# Altium schematic sheet Sensors.SchDoc: Payload Card Sensors
size A3; Revision: 1A; SheetNumber: 5; SheetTotal: 6; Organization: Brickworks; Address1: Matthew Glazer; Address2: Design Engineer
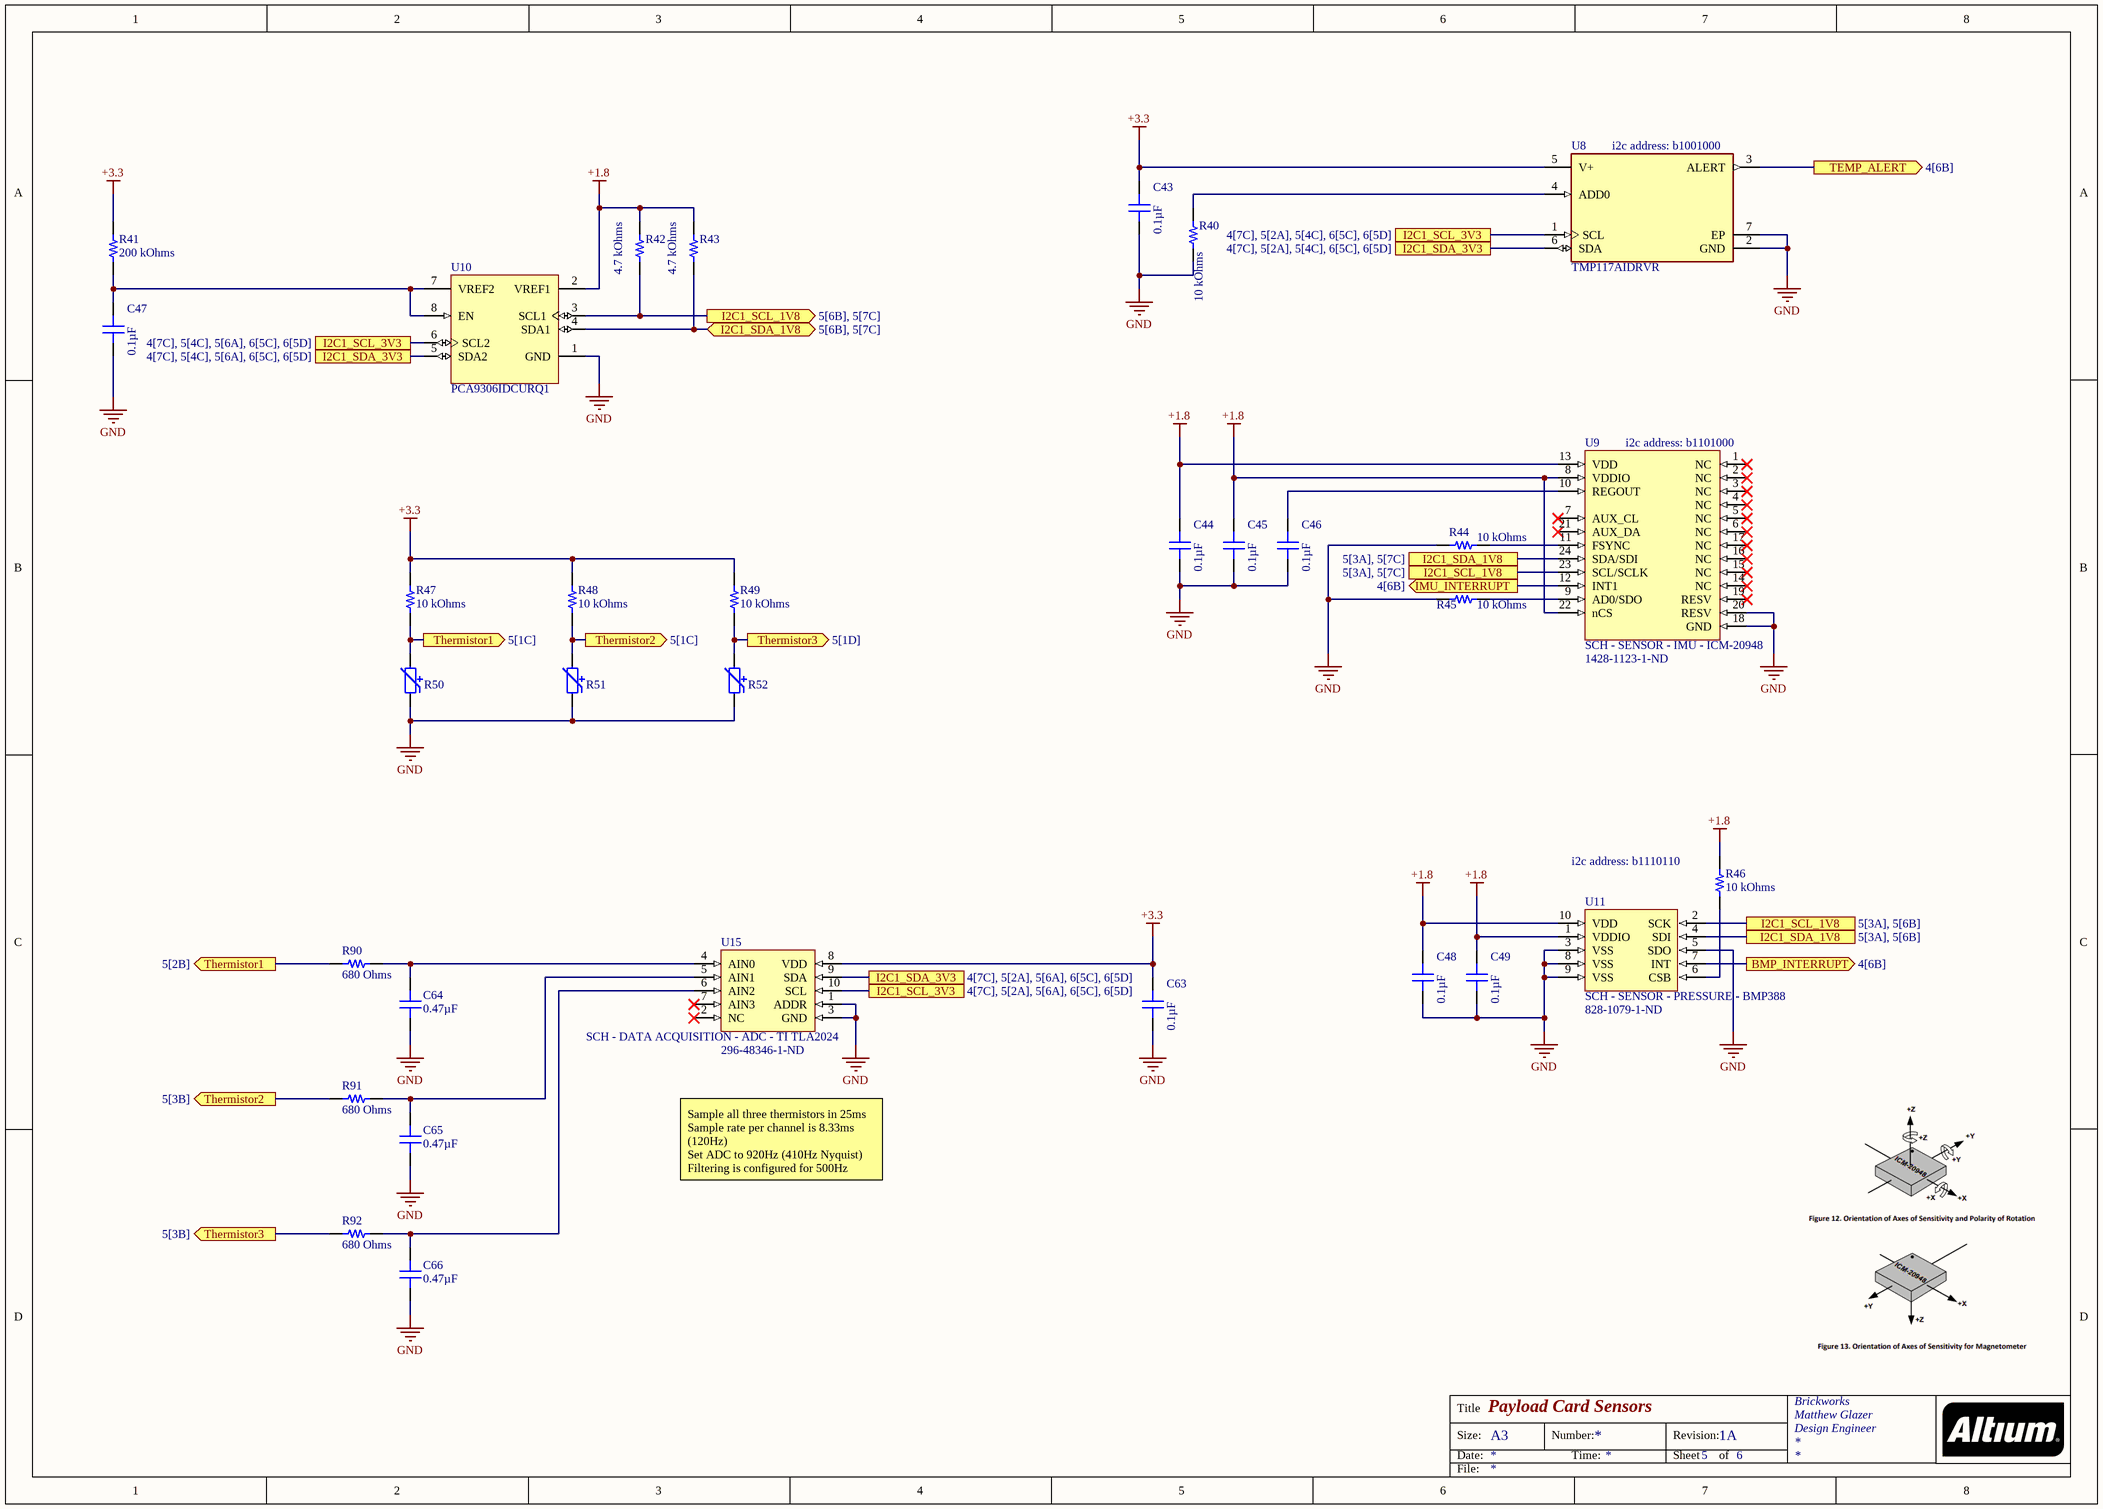
[diagram p0: Sensors.SchDoc]

## Parts
C43  0.1µF  [CAP 0603_1608]
C44  0.1µF  [CAP 0603_1608]
C45  0.1µF  [CAP 0603_1608]
C46  0.1µF  [CAP 0603_1608]
C47  0.1µF  [CAP 0603_1608]
C48  0.1µF  [CAP 0603_1608]
C49  0.1µF  [CAP 0603_1608]
C63  0.1µF  [CAP 0603_1608]
C64  0.47µF  [CAP 0603_1608]
C65  0.47µF  [CAP 0603_1608]
C66  0.47µF  [CAP 0603_1608]
R40  10 kOhms  [RES 0603_1608]
R41  200 kOhms  [RES 0603_1608]
R42  4.7 kOhms  [RES 0603_1608]
R43  4.7 kOhms  [RES 0603_1608]
R44  10 kOhms  [RES 0603_1608]
R45  10 kOhms  [RES 0603_1608]
R46  10 kOhms  [RES 0603_1608]
R47  10 kOhms  [RES 0603_1608]
R48  10 kOhms  [RES 0603_1608]
R49  10 kOhms  [RES 0603_1608]
R50  10 kOhms  [PTC 0402_1005]  (value not drawn)
R51  10 kOhms  [PTC 0402_1005]  (value not drawn)
R52  10 kOhms  [PTC 0402_1005]  (value not drawn)
R90  680 Ohms  [RES 0603_1608]
R91  680 Ohms  [RES 0603_1608]
R92  680 Ohms  [RES 0603_1608]
U8  TMP117AIDRVR  [FP-DRV0006A-MFG]
U9  SCH - SENSOR - IMU - ICM-20948  Supplier Part Number 1: 1428-1123-1-ND  [PCB - LEADLESS - QFN - TDK 24-TFQFN]
U10  PCA9306IDCURQ1  [DCU0008A_M]
U11  SCH - SENSOR - PRESSURE - BMP388  Supplier Part Number 1: 828-1079-1-ND  [PCB - LEADLESS - BOSCH LGA10]
U15  SCH - DATA ACQUISITION - ADC - TI TLA2024  Supplier Part Number 1: 296-48346-1-ND  [PCB - LEADLESS - QFN - TI X2QFN-10]

## Ports
BMP_INTERRUPT (out, see 4[6B]), I2C1_SCL_1V8 (out, see 5[6B], 5[7C]), I2C1_SCL_1V8 (see 5[3A], 5[6B]), I2C1_SCL_1V8 (see 5[3A], 5[7C]), I2C1_SCL_3V3 (see 4[7C], 5[2A], 5[4C], 6[5C], 6[5D]), I2C1_SCL_3V3 (see 4[7C], 5[2A], 5[6A], 6[5C], 6[5D]), I2C1_SCL_3V3 (see 4[7C], 5[4C], 5[6A], 6[5C], 6[5D]), I2C1_SDA_1V8 (bidir, see 5[6B], 5[7C]), I2C1_SDA_1V8 (see 5[3A], 5[6B]), I2C1_SDA_1V8 (see 5[3A], 5[7C]), I2C1_SDA_3V3 (see 4[7C], 5[2A], 5[4C], 6[5C], 6[5D]), I2C1_SDA_3V3 (see 4[7C], 5[2A], 5[6A], 6[5C], 6[5D]), I2C1_SDA_3V3 (see 4[7C], 5[4C], 5[6A], 6[5C], 6[5D]), IMU_INTERRUPT (out, see 4[6B]), TEMP_ALERT (out, see 4[6B]), Thermistor1 (out, see 5[1C]), Thermistor1 (out, see 5[2B]), Thermistor2 (out, see 5[1C]), Thermistor2 (out, see 5[3B]), Thermistor3 (out, see 5[1D]), Thermistor3 (out, see 5[3B])

## Nets
+1.8: C44.2 C45.2 C48.2 C49.2 R42.2 R43.2 R46.1 U9.8(VDDIO) U9.13(VDD) U9.22(nCS) U10.2(VREF1) U11.1(VDDIO) U11.10(VDD)
+3.3: C43.2 C63.2 R41.2 R47.2 R48.2 R49.2 U8.5(V+) U15.8(VDD)
GND: C43.1 C44.1 C45.1 C46.1 C47.1 C48.1 C49.1 C63.1 C64.1 C65.1 C66.1 R40.1 R44.2 R45.2 R50.1 R51.1 R52.1 U8.2(GND) U8.7(EP) U9.18(GND) U9.20(RESV) U10.1(GND) U11.3(VSS) U11.5(SDO) U11.8(VSS) U11.9(VSS) U15.1(ADDR) U15.3(GND)
BMP_INTERRUPT: U11.7(INT) ; port BMP_INTERRUPT
I2C1_SCL_1V8: R42.1 U9.23(SCL/SCLK) U10.3(SCL1) U11.2(SCK) ; port I2C1_SCL_1V8
I2C1_SCL_3V3: U8.1(SCL) U10.6(SCL2) U15.10(SCL) ; port I2C1_SCL_3V3
I2C1_SDA_1V8: R43.1 U9.24(SDA/SDI) U10.4(SDA1) U11.4(SDI) ; port I2C1_SDA_1V8
I2C1_SDA_3V3: U8.6(SDA) U10.5(SDA2) U15.9(SDA) ; port I2C1_SDA_3V3
IMU_INTERRUPT: U9.12(INT1) ; port IMU_INTERRUPT
TEMP_ALERT: U8.3(ALERT) ; port TEMP_ALERT
Thermistor1: R47.1 R50.2 R90.1 ; port Thermistor1
Thermistor2: R48.1 R51.2 R91.1 ; port Thermistor2
Thermistor3: R49.1 R52.2 R92.1 ; port Thermistor3
NetC46_2: C46.2 U9.10(REGOUT)
NetC47_2: C47.2 R41.1 U10.7(VREF2) U10.8(EN)
NetC64_2: C64.2 R90.2 U15.4(AIN0)
NetC65_2: C65.2 R91.2 U15.5(AIN1)
NetC66_2: C66.2 R92.2 U15.6(AIN2)
NetR40_2: R40.2 U8.4(ADD0)
NetR44_1: R44.1 U9.11(FSYNC)
NetR45_1: R45.1 U9.9(AD0/SDO)
NetR46_2: R46.2 U11.6(CSB)

Not connected (* = marked no-connect by the designer): U9 1(NC)* 2(NC)* 3(NC)* 4(NC)* 5(NC)* 6(NC)* 7(AUX_CL)* 14(NC)* 15(NC)* 16(NC)* 17(NC)* 19(RESV)* 21(AUX_DA)*; U15 2(NC)* 7(AIN3)*

## Notes on the sheet
- (near U8) i2c address: b1001000
- (near U9) i2c address: b1101000
- (near R46) i2c address: b1110110
- Sample all three thermistors in 25ms
  Sample rate per channel is 8.33ms (120Hz)
  Set ADC to 920Hz (410Hz Nyquist)
  Filtering is configured for 500Hz
- Title
- Size:
- Date:
- A3
- Number:
- Time:
- Revision:
- Sheet
- of
- File:

## Library data of the parts
C43-C49 C63 = CL10B104KA8WPNC: CAP CER 0.1UF 25V X7R 0603; Manufacturer: Samsung Electro-Mechanics; Tolerance: ±10%; Part Number: CL10B104KA8WPNC; Value: 0.1µF; Applications: Automotive; Capacitance: 0.1µF; ComponentLink1Description: Datasheet; ComponentLink1URL: http://www.samsungsem.com/kr/support/product-search/mlcc/CL10B104KA8WPNC.jsp; ComponentLink2Description: DigiKey Link; ComponentLink2URL: http://digikey.com/product-detail/en/samsung-electro-mechanics/CL10B104KA8WPNC/1276-6717-1-ND/5961576; Device Package: 0603 (1608 Metric); Features: Open Mode; LastUpdated: 9/2/2020 1:03:30 AM; Lifecycle Status: Active; Minimum Order: 1; Mounting Type: Surface Mount, MLCC; Operating Temperature: -55°C ~ 125°C; Package / Case: 0603 (1608 Metric); Packaging: TapeAndReel; PartId: 5631; Part Status: Active; Price: 0.02; Ratings: AEC-Q200; Series: CL; Size / Dimension: 0.063" L x 0.031" W (1.60mm x 0.80mm); Supplier 1: DigiKey; Supplier Part Number 1: 1276-6717-1-ND; Temperature Coefficient: X7R; Thickness (Max): 0.035" (0.90mm); Voltage - Rated: 25V
C64-C66 = C0603C474K4PACTU: CAP CER 0.47UF 16V X5R 0603; Manufacturer: KEMET; Tolerance: ±10%; Part Number: C0603C474K4PACTU; Value: 0.47µF; Applications: General Purpose; Capacitance: 0.47µF; ComponentLink1Description: Datasheet; ComponentLink1URL: https://api.kemet.com/component-edge/download/datasheet/C0603C474K4PACTU.pdf; ComponentLink2Description: DigiKey Link; ComponentLink2URL: http://digikey.com/product-detail/en/kemet/C0603C474K4PACTU/399-7934-1-ND/3471657; Device Package: 0603 (1608 Metric); LastUpdated: 9/2/2020 1:03:36 AM; Lifecycle Status: Active; Minimum Order: 1; Mounting Type: Surface Mount, MLCC; Operating Temperature: -55°C ~ 85°C; Package / Case: 0603 (1608 Metric); Packaging: TapeAndReel; PartId: 2292; Part Status: Active; Price: 0.02; Series: SMD Comm X5R; Size / Dimension: 0.063" L x 0.031" W (1.60mm x 0.80mm); Supplier 1: DigiKey; Supplier Part Number 1: 399-7934-1-ND; Temperature Coefficient: X5R; Thickness (Max): 0.034" (0.87mm); Voltage - Rated: 16V
R40 R44-R46 = RMCF0603JT10K0: RES 10K OHM 5% 1/10W 0603; Manufacturer: Stackpole Electronics Inc; Power (Watts): 0.1W, 1/10W; Temperature Coefficient: ±200ppm/°C; Part Number: RMCF0603JT10K0; Value: 10 kOhms; ComponentLink1Description: Datasheet; ComponentLink1URL: https://www.seielect.com/catalog/sei-packaging.pdf; ComponentLink2Description: DigiKey Link; ComponentLink2URL: http://digikey.com/product-detail/en/stackpole-electronics-inc/RMCF0603JT10K0/RMCF0603JT10K0CT-ND/1943191; Composition: Thick Film; Device Package: 0603 (1608 Metric); Features: Automotive AEC-Q200; Height - Seated (Max): 0.022" (0.55mm); LastUpdated: 8/30/2020 8:48:45 PM; Lifecycle Status: Active; Minimum Order: 1; Number of Terminations: 2; Operating Temperature: -55°C ~ 155°C; Package / Case: 0603 (1608 Metric); Packaging: CutTape; PartId: 25659; Part Status: Active; Price: 0.10; Ratings: AEC-Q200; Resistance: 10 kOhms; Series: RMCF; Size / Dimension: 0.061" L x 0.031" W (1.55mm x 0.80mm); Supplier 1: DigiKey; Supplier Part Number 1: RMCF0603JT10K0CT-ND; Supplier Device Package: 0603; Tolerance: ±5%
R41 = RMCF0603FT200K: RES 200K OHM 1% 1/10W 0603; Manufacturer: Stackpole Electronics Inc; Power (Watts): 0.1W, 1/10W; Temperature Coefficient: ±100ppm/°C; Part Number: RMCF0603FT200K; Value: 200 kOhms; ComponentLink1Description: Datasheet; ComponentLink1URL: https://www.seielect.com/catalog/sei-rmcf_rmcp.pdf; ComponentLink2Description: DigiKey Link; ComponentLink2URL: http://digikey.com/product-detail/en/stackpole-electronics-inc/RMCF0603FT200K/RMCF0603FT200KCT-ND/1943126; Composition: Thick Film; Device Package: 0603 (1608 Metric); Features: Automotive AEC-Q200; Height - Seated (Max): 0.022" (0.55mm); LastUpdated: 9/2/2020 1:10:13 AM; Lifecycle Status: Active; Minimum Order: 1; Number of Terminations: 2; Operating Temperature: -55°C ~ 155°C; Package / Case: 0603 (1608 Metric); Packaging: CutTape; PartId: 10646; Part Status: Active; Price: 0.10; Ratings: AEC-Q200; Resistance: 200 kOhms; Series: RMCF; Size / Dimension: 0.061" L x 0.031" W (1.55mm x 0.80mm); Supplier 1: DigiKey; Supplier Part Number 1: RMCF0603FT200KCT-ND; Supplier Device Package: 0603; Tolerance: ±1%
R42 R43 = RMCF0603FT4K70: RES 4.7K OHM 1% 1/10W 0603; Manufacturer: Stackpole Electronics Inc; Power (Watts): 0.1W, 1/10W; Temperature Coefficient: ±100ppm/°C; Part Number: RMCF0603FT4K70; Value: 4.7 kOhms; ComponentLink1Description: Datasheet; ComponentLink1URL: https://www.seielect.com/catalog/sei-rmcf_rmcp.pdf; ComponentLink2Description: DigiKey Link; ComponentLink2URL: http://digikey.com/product-detail/en/stackpole-electronics-inc/RMCF0603FT4K70/RMCF0603FT4K70CT-ND/1943033; Composition: Thick Film; Device Package: 0603 (1608 Metric); Features: Automotive AEC-Q200; Height - Seated (Max): 0.022" (0.55mm); LastUpdated: 9/2/2020 1:10:22 AM; Lifecycle Status: Active; Minimum Order: 1; Number of Terminations: 2; Operating Temperature: -55°C ~ 155°C; Package / Case: 0603 (1608 Metric); Packaging: CutTape; PartId: 6078; Part Status: Active; Price: 0.10; Ratings: AEC-Q200; Resistance: 4.7 kOhms; Series: RMCF; Size / Dimension: 0.061" L x 0.031" W (1.55mm x 0.80mm); Supplier 1: DigiKey; Supplier Part Number 1: RMCF0603FT4K70CT-ND; Supplier Device Package: 0603; Tolerance: ±1%
R47-R49 = RMCF0603FT10K0: RES 10K OHM 1% 1/10W 0603; Manufacturer: Stackpole Electronics Inc; Power (Watts): 0.1W, 1/10W; Temperature Coefficient: ±100ppm/°C; Part Number: RMCF0603FT10K0; Value: 10 kOhms; ComponentLink1Description: Datasheet; ComponentLink1URL: https://www.seielect.com/catalog/sei-rmcf_rmcp.pdf; ComponentLink2Description: DigiKey Link; ComponentLink2URL: http://digikey.com/product-detail/en/stackpole-electronics-inc/RMCF0603FT10K0/RMCF0603FT10K0CT-ND/1943057; Composition: Thick Film; Device Package: 0603 (1608 Metric); Features: Automotive AEC-Q200; Height - Seated (Max): 0.022" (0.55mm); LastUpdated: 9/2/2020 1:09:31 AM; Lifecycle Status: Active; Minimum Order: 1; Number of Terminations: 2; Operating Temperature: -55°C ~ 155°C; Package / Case: 0603 (1608 Metric); Packaging: CutTape; PartId: 25663; Part Status: Active; Price: 0.10; Ratings: AEC-Q200; Resistance: 10 kOhms; Series: RMCF; Size / Dimension: 0.061" L x 0.031" W (1.55mm x 0.80mm); Supplier 1: DigiKey; Supplier Part Number 1: RMCF0603FT10K0CT-ND; Supplier Device Package: 0603; Tolerance: ±1%
R50-R52 = TMP6131DECR: SENSOR PTC 10KOHM 1% X1SON; Manufacturer: Texas Instruments; ComponentLink1Description: Datasheet; ComponentLink1URL: http://www.ti.com/general/docs/suppproductinfo.tsp?distId=10&gotoUrl=http%3A%2F%2Fwww.ti.com%2Flit%2Fgpn%2Ftmp61; ComponentLink2Description: DigiKey Link; ComponentLink2URL: http://digikey.com/product-detail/en/texas-instruments/TMP6131DECR/296-TMP6131DECRCT-ND/10435285; Device Package: 0402 (1006 Metric); LastUpdated: 9/2/2020 1:30:57 AM; Lifecycle Status: Active; Part Number: TMP6131DECR; Minimum Order: 1; Mounting Type: Surface Mount; Operating Temperature: -40°C ~ 125°C (TA); Package / Case: 0402 (1006 Metric); Packaging: TapeAndReel; Part Status: Active; Price: 0.07; Resistance @ 25°C: 10 kOhms; Resistance Tolerance: ±1%; Series: Commercial; Supplier 1: DigiKey; Supplier Part Number 1: 296-TMP6131DECRCT-ND; Supplier Device Package: 2-X1SON (1x.60); Value: 10 kOhms
R90-R92 = RMCF0603FT680R: RES 680 OHM 1% 1/10W 0603; Manufacturer: Stackpole Electronics Inc; Power (Watts): 0.1W, 1/10W; Temperature Coefficient: ±100ppm/°C; Part Number: RMCF0603FT680R; Value: 680 Ohms; ComponentLink1Description: Datasheet; ComponentLink1URL: https://www.seielect.com/catalog/sei-packaging.pdf; ComponentLink2Description: DigiKey Link; ComponentLink2URL: http://digikey.com/product-detail/en/stackpole-electronics-inc/RMCF0603FT680R/RMCF0603FT680RCT-ND/6053170; Composition: Thick Film; Device Package: 0603 (1608 Metric); Features: Automotive AEC-Q200; Height - Seated (Max): 0.022" (0.55mm); LastUpdated: 9/2/2020 1:10:13 AM; Lifecycle Status: Active; Minimum Order: 1; Number of Terminations: 2; Operating Temperature: -55°C ~ 155°C; Package / Case: 0603 (1608 Metric); Packaging: CutTape; PartId: 10671; Part Status: Active; Price: 0.10; Ratings: AEC-Q200; Resistance: 680 Ohms; Series: RMCF; Size / Dimension: 0.061" L x 0.031" W (1.55mm x 0.80mm); Supplier 1: DigiKey; Supplier Part Number 1: RMCF0603FT680RCT-ND; Supplier Device Package: 0603; Tolerance: ±1%
U8 = CMP-04948-000009-1: TEMPERATURE SENSOR; Manufacturer: Texas Instruments; Operating Supply Current: 3.5-16uA; Standoff Height: 0mm; Min Supply Voltage: 1.8V; Resolution: 16bits; Interface: I2C,2-Wire,SMBus; Max Junction Temp: +150°C; Max Supply Voltage: 5.5V; Octopart: https://octopart.com/tmp117aidrvr-texas+instruments-95511044; Lead Free: Yes; ComponentLink2Description: Datasheet; Temperature Range High: +150°C; Manufacturer Part Number: TMP117AIDRVR; Ambient Temperature Range High: +150°C; Ambient Temperature Range Low: -55°C; Height: 0.8mm; ComponentLink2URL: http://www.ti.com/lit/ds/symlink/tmp117.pdf; Automotive: No; Device Class L1: Sensors; RoHS: TRUE; Package: DRV0006A; Device Class L3: unset; Temperature: -55°C to +150°C; Temperature Range Low: -55°C; Ipc Land Pattern Name: DFN200X200X80-6; Device Class L2: Temperature and Humidity Sensors; Category: IC; Digikey Description: TEMPERATURE SENSOR
U10 = CMP-0314-00424-2: Automotive Catalog Dual Bidirectional I2C Bus and SMBus Voltage-Level Translator, 0 to 5.5 V,-40 to 85 degC,8-pin US8 (DCU), Green (RoHS & no Sb/Br); Manufacturer: Texas Instruments; fSCLK(Max)(MHz): 400; Vcc range(V): 0 to 5.5; 5V Tolerant I/O: Yes; tpd max(ns): 1.4; Function: Voltage Translator; SubFamily: I2C Special Function; No. of Outputs: 2; Mounting Technology: Surface Mount; ComponentLink1Description: Datasheet; ComponentLink2Description: Package Specification; PackageReference: DCU0008A; Rating: Automotive; PackageVersion: revF, Jul-2005; Eco-Plan: Green (RoHS & no Sb/Br); ComponentLink2URL: http://www.ti.com/litv/pdf/mpds050d; Max Frequency(kHz): 400; Open Drain I/O Type: Yes; On-Chip Power-on-Reset: No; PartNumber: PCA9306IDCURQ1; Code_JEDEC: MO-187-CA; DatasheetVersion: SCPS178; PackageDescription: 8-Pin Thin Shrink Small Outline Package 0.5 mm Pitch; ComponentLink1URL: http://www.ti.com/general/docs/lit/getliterature.tsp?genericPartNumber=PCA9306-Q1&fileType=pdf; Enable Pin: Yes
U9 = SCH - SENSOR - IMU - ICM-20948: Supplier 1: Digi-Key
U11 = SCH - SENSOR - PRESSURE - BMP388: Supplier 1: Digi-Key
U15 = SCH - DATA ACQUISITION - ADC - TI TLA2024: Supplier 1: Digi-Key